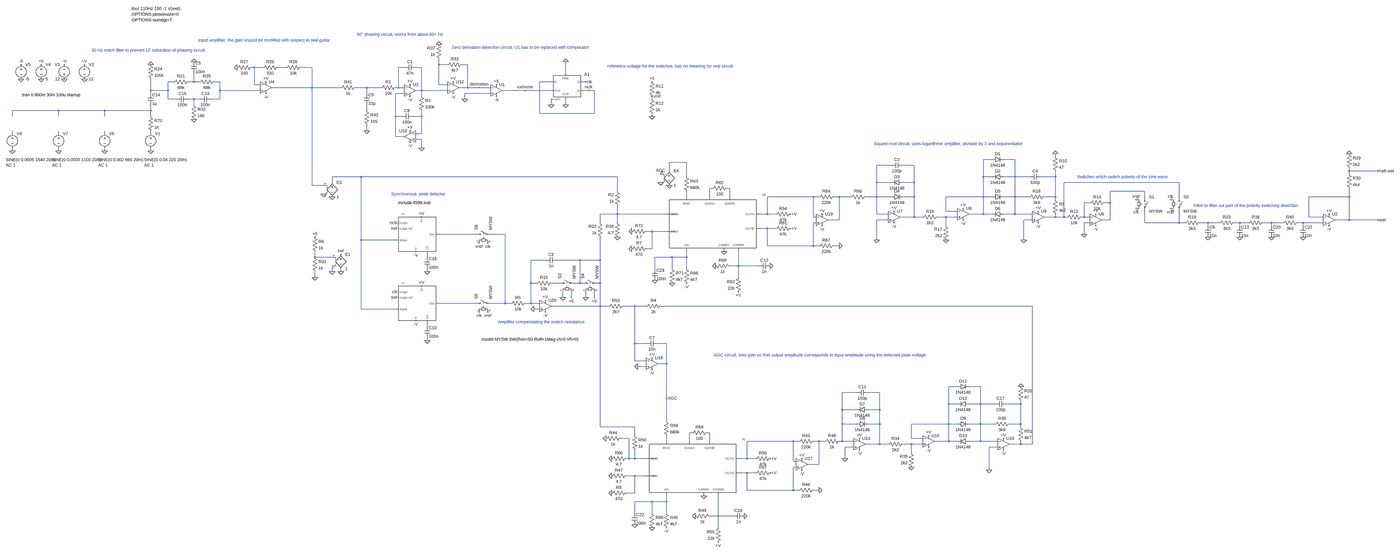
[diagram p0: schematic subharmonic_generator.asc, whole sheet]
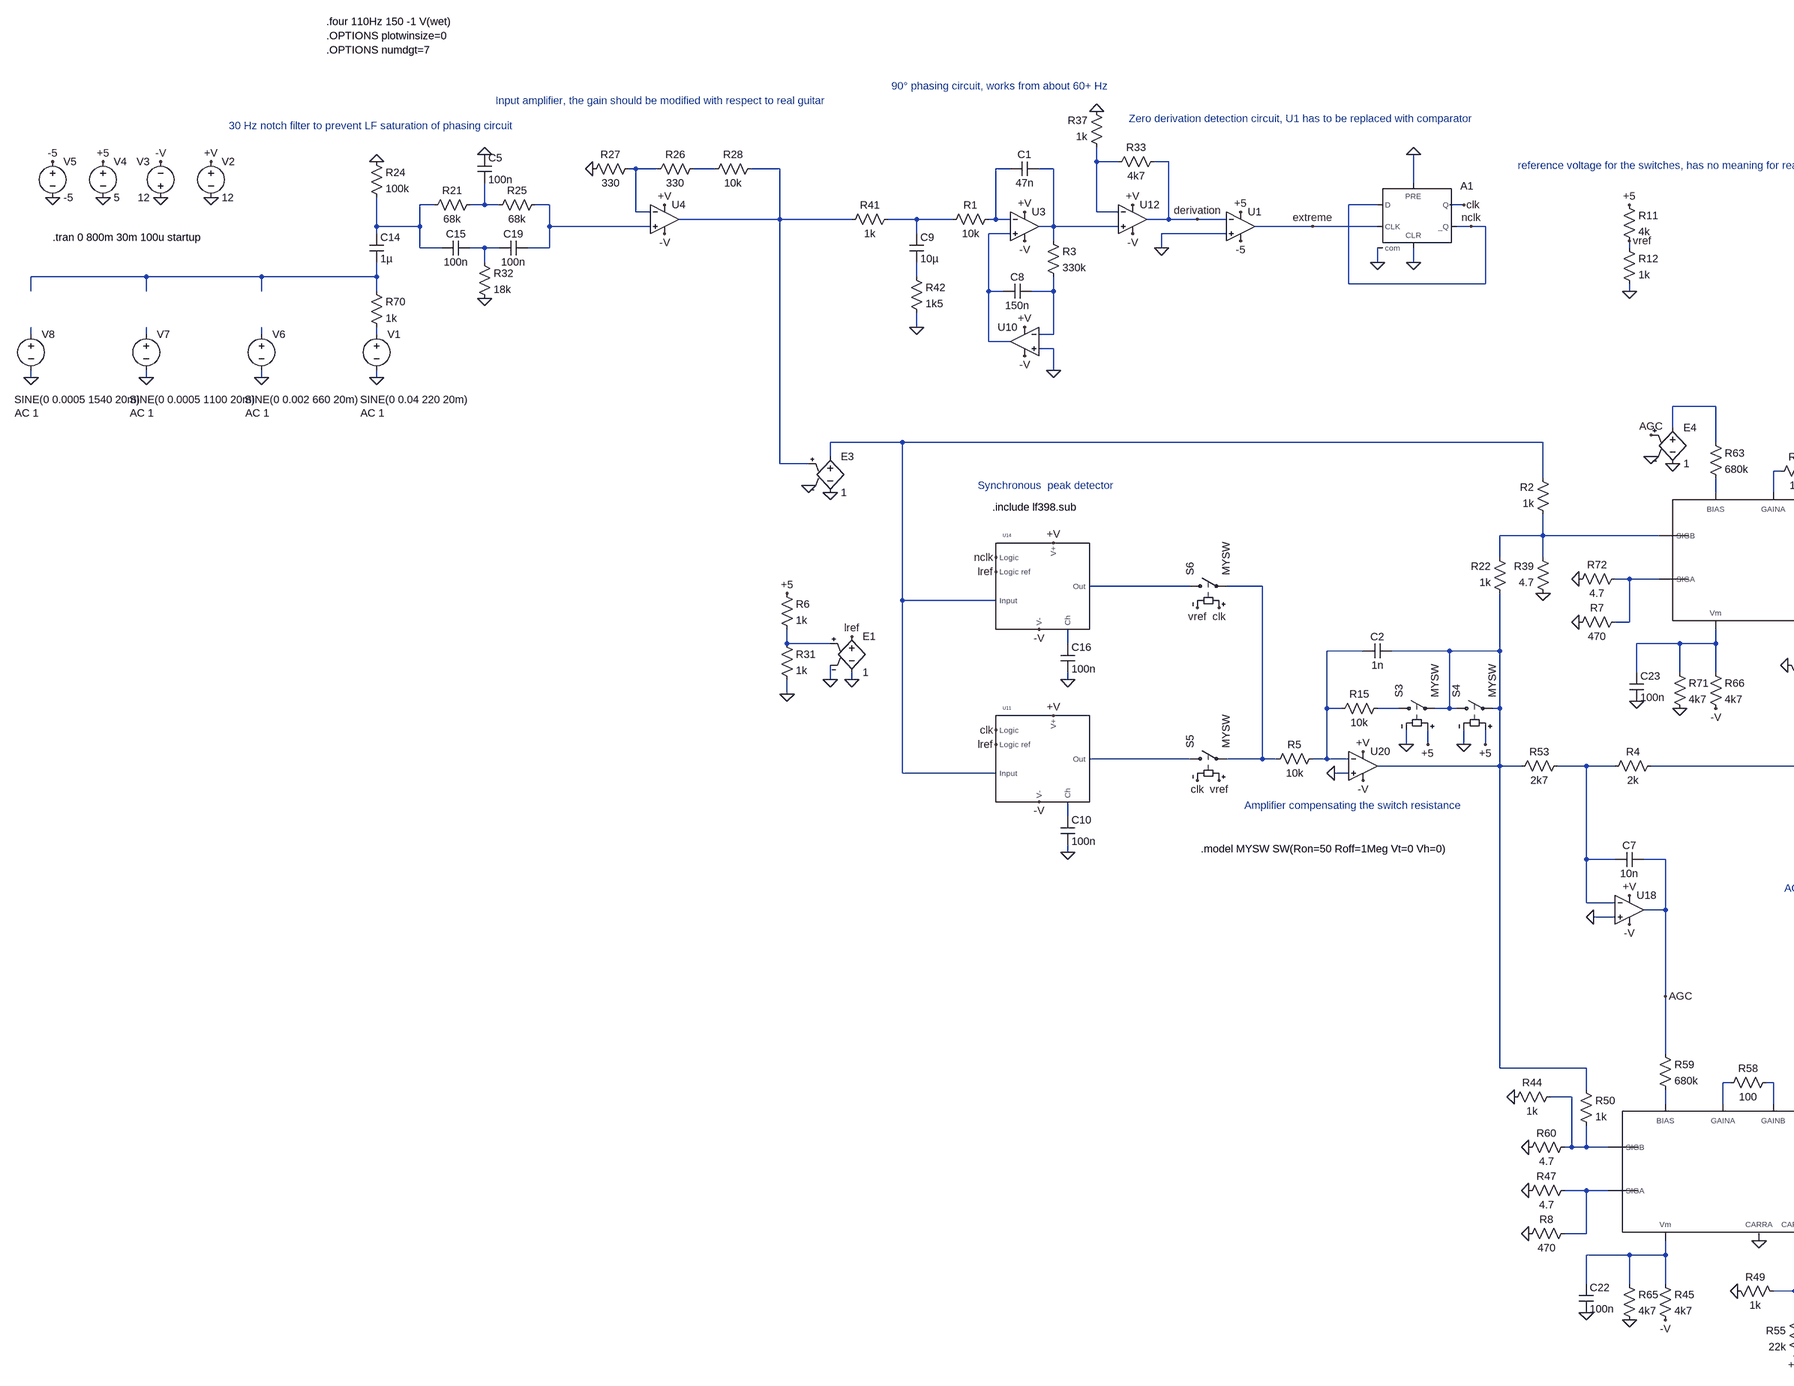
[diagram p1: schematic subharmonic_generator.asc, part, row 1 of 1, column 1 of 2]
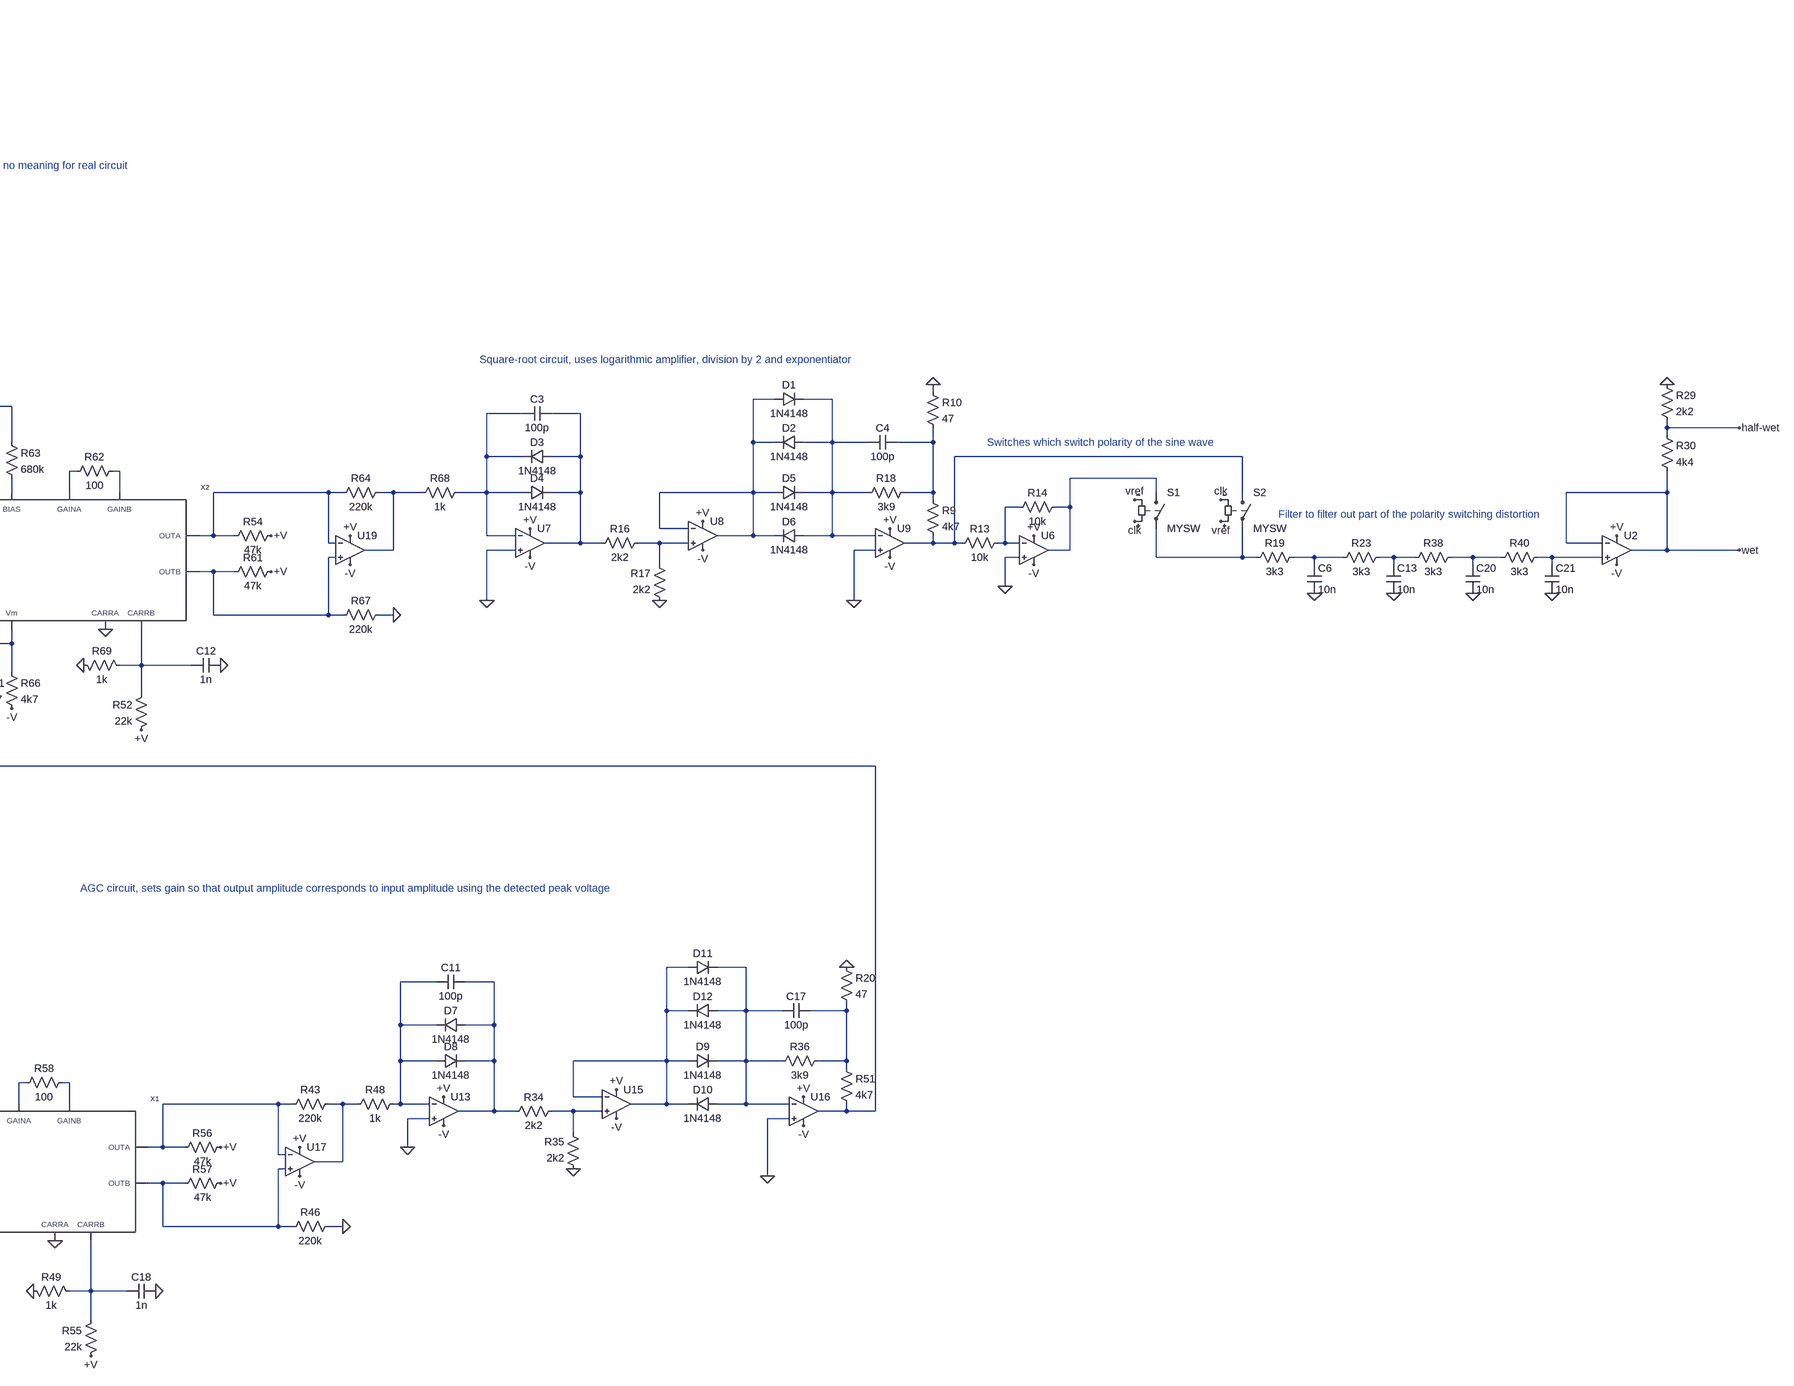
[diagram p2: schematic subharmonic_generator.asc, part, row 1 of 1, column 2 of 2]
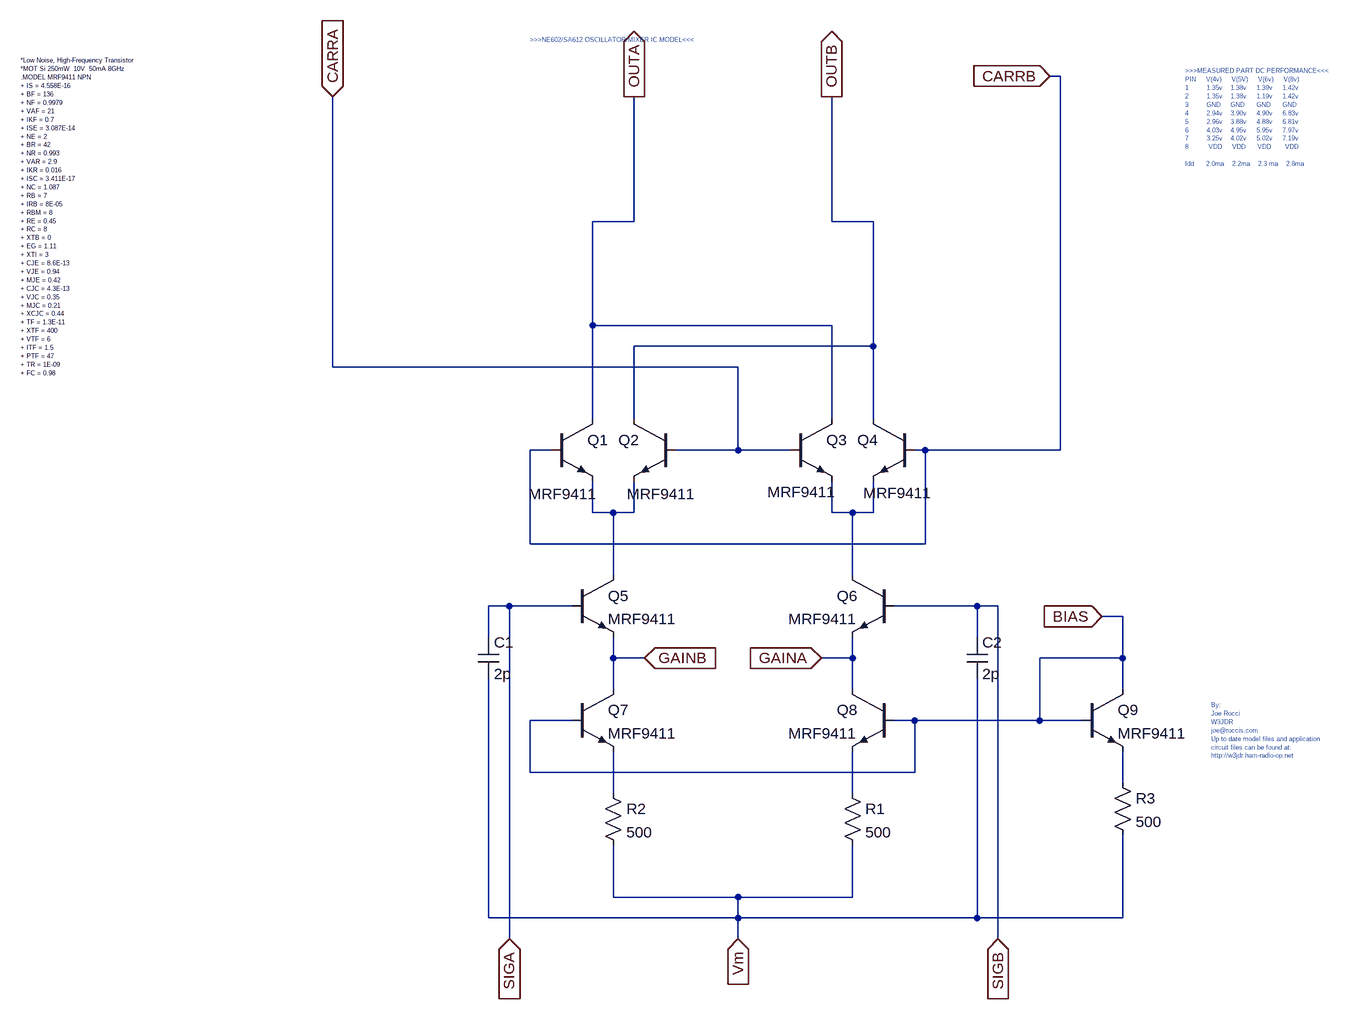
[diagram p3: sub-circuit gilbert.asc]
subharmonic_generator.asc, the LTspice schematic file:
Version 4
SHEET 1 5952 2332
WIRE 480 -400 480 -432
WIRE 528 -400 480 -400
WIRE 640 -400 608 -400
WIRE -544 -384 -560 -384
WIRE -496 -384 -544 -384
WIRE -368 -384 -416 -384
WIRE -224 -384 -288 -384
WIRE 288 -384 256 -384
WIRE 384 -384 352 -384
WIRE 1184 -352 1184 -416
WIRE -992 -304 -1024 -304
WIRE -880 -304 -880 -352
WIRE -880 -304 -912 -304
WIRE -848 -304 -880 -304
WIRE -736 -304 -768 -304
WIRE 1104 -304 1040 -304
WIRE 1296 -304 1264 -304
WIRE -544 -288 -544 -384
WIRE -512 -288 -544 -288
WIRE 480 -288 480 -400
WIRE 528 -288 480 -288
WIRE -224 -272 -224 -384
WIRE -224 -272 -448 -272
WIRE -64 -272 -224 -272
WIRE 80 -272 16 -272
WIRE 160 -272 80 -272
WIRE 256 -272 256 -384
WIRE 256 -272 240 -272
WIRE 288 -272 256 -272
WIRE 640 -272 640 -400
WIRE 640 -272 592 -272
WIRE 704 -272 640 -272
WIRE 768 -272 704 -272
WIRE -1120 -256 -1120 -320
WIRE -1024 -256 -1024 -304
WIRE -1024 -256 -1120 -256
WIRE -736 -256 -736 -304
WIRE -512 -256 -736 -256
WIRE 384 -256 384 -384
WIRE 384 -256 352 -256
WIRE 528 -256 384 -256
WIRE 960 -256 832 -256
WIRE 1104 -256 960 -256
WIRE 1312 -256 1280 -256
WIRE 1344 -256 1312 -256
WIRE -1120 -240 -1120 -256
WIRE 80 -240 80 -272
WIRE 288 -240 240 -240
WIRE 768 -240 624 -240
WIRE 384 -224 384 -256
WIRE -1024 -208 -1024 -256
WIRE -976 -208 -1024 -208
WIRE -880 -208 -912 -208
WIRE -848 -208 -880 -208
WIRE -736 -208 -736 -256
WIRE -736 -208 -784 -208
WIRE 624 -208 624 -240
WIRE 1664 -208 1664 -224
WIRE -880 -176 -880 -208
WIRE 1104 -176 1104 -208
WIRE 1184 -176 1184 -208
WIRE -1632 -144 -1888 -144
WIRE -1376 -144 -1632 -144
WIRE -1120 -144 -1120 -176
WIRE -1120 -144 -1376 -144
WIRE 80 -144 80 -176
WIRE 1040 -128 1040 -304
WIRE 1344 -128 1344 -256
WIRE 1344 -128 1040 -128
WIRE -1888 -112 -1888 -144
WIRE -1632 -112 -1632 -144
WIRE -1376 -112 -1376 -144
WIRE -1120 -112 -1120 -144
WIRE 240 -112 240 -240
WIRE 272 -112 240 -112
WIRE 384 -112 384 -144
WIRE 384 -112 336 -112
WIRE 1664 -112 1664 -128
WIRE 80 -32 80 -64
WIRE -1888 -16 -1888 -32
WIRE -1632 -16 -1632 -32
WIRE -1376 -16 -1376 -32
WIRE -1120 -16 -1120 -32
WIRE 384 -16 384 -112
WIRE 384 -16 352 -16
WIRE 240 0 240 -112
WIRE 288 0 240 0
WIRE 384 16 352 16
WIRE 384 64 384 16
WIRE -1888 80 -1888 64
WIRE -1632 80 -1632 64
WIRE -1376 80 -1376 64
WIRE -1120 80 -1120 64
WIRE 3904 112 3904 96
WIRE 3552 128 3504 128
WIRE 3680 128 3616 128
WIRE 1856 144 1760 144
WIRE 2992 160 2912 160
WIRE 3120 160 3056 160
WIRE 1760 192 1760 144
WIRE 5536 192 5536 176
WIRE 5696 192 5536 192
WIRE 5536 208 5536 192
WIRE 48 224 -112 224
WIRE 1472 224 48 224
WIRE 1856 224 1856 144
WIRE 3504 224 3504 128
WIRE 3552 224 3504 224
WIRE 3680 224 3680 128
WIRE 3680 224 3616 224
WIRE 3760 224 3680 224
WIRE 3904 224 3904 192
WIRE 3904 224 3824 224
WIRE -112 256 -112 224
WIRE 2912 256 2912 160
WIRE 2992 256 2912 256
WIRE 3120 256 3120 160
WIRE 3120 256 3056 256
WIRE 4592 256 3952 256
WIRE -224 272 -224 -272
WIRE -160 272 -224 272
WIRE 2000 288 1984 288
WIRE 2096 288 2080 288
WIRE 1472 304 1472 224
WIRE 4400 304 4208 304
WIRE 1856 336 1856 304
WIRE 1984 336 1984 288
WIRE 2096 336 2096 288
WIRE 2560 336 2304 336
WIRE 2592 336 2560 336
WIRE 2704 336 2672 336
WIRE 2768 336 2704 336
WIRE 2912 336 2912 256
WIRE 2912 336 2848 336
WIRE 2992 336 2912 336
WIRE 3120 336 3120 256
WIRE 3120 336 3056 336
WIRE 3504 336 3504 224
WIRE 3504 336 3296 336
WIRE 3552 336 3504 336
WIRE 3680 336 3680 224
WIRE 3680 336 3616 336
WIRE 3760 336 3680 336
WIRE 3904 336 3904 224
WIRE 3904 336 3840 336
WIRE 4400 336 4400 304
WIRE 4592 336 4592 256
WIRE 5536 336 5536 288
WIRE 5536 336 5312 336
WIRE 3904 352 3904 336
WIRE 4096 368 4064 368
WIRE 4208 368 4208 304
WIRE 4208 368 4176 368
WIRE 3296 416 3296 336
WIRE 3360 416 3296 416
WIRE 1472 432 1472 384
WIRE 1472 432 1376 432
WIRE 1728 432 1472 432
WIRE 2304 432 2304 336
WIRE 2304 432 2272 432
WIRE 2352 432 2304 432
WIRE 2912 432 2912 336
WIRE 2976 432 2912 432
WIRE 3504 432 3504 336
WIRE 3504 432 3424 432
WIRE 3552 432 3504 432
WIRE 3680 432 3680 336
WIRE 3680 432 3616 432
WIRE 3776 432 3680 432
WIRE 2560 448 2560 336
WIRE 2576 448 2560 448
WIRE 3120 448 3120 336
WIRE 3120 448 3040 448
WIRE 3168 448 3120 448
WIRE 3296 448 3248 448
WIRE 3360 448 3296 448
WIRE 3904 448 3904 432
WIRE 3904 448 3840 448
WIRE 3952 448 3952 256
WIRE 3952 448 3904 448
WIRE 3968 448 3952 448
WIRE 4064 448 4064 368
WIRE 4064 448 4048 448
WIRE 4096 448 4064 448
WIRE 5312 448 5312 336
WIRE 5392 448 5312 448
WIRE 2704 464 2704 336
WIRE 2704 464 2640 464
WIRE 2976 464 2912 464
WIRE 3776 464 3728 464
WIRE 4208 464 4208 368
WIRE 4208 464 4160 464
WIRE 5536 464 5536 336
WIRE 5536 464 5456 464
WIRE 5696 464 5536 464
WIRE 1376 480 1376 432
WIRE 1472 480 1472 432
WIRE 2576 480 2560 480
WIRE 4096 480 4064 480
WIRE 4400 480 4400 416
WIRE 4592 480 4592 416
WIRE 4592 480 4400 480
WIRE 4624 480 4592 480
WIRE 4752 480 4704 480
WIRE 4816 480 4752 480
WIRE 4928 480 4896 480
WIRE 4976 480 4928 480
WIRE 5104 480 5056 480
WIRE 5168 480 5104 480
WIRE 5280 480 5248 480
WIRE 5392 480 5280 480
WIRE 3296 496 3296 448
WIRE 4752 496 4752 480
WIRE 4928 496 4928 480
WIRE 5104 496 5104 480
WIRE 5280 496 5280 480
WIRE 2304 512 2272 512
WIRE 2352 512 2304 512
WIRE 1664 528 1632 528
WIRE 1728 528 1664 528
WIRE 688 544 464 544
WIRE 848 544 768 544
WIRE 4064 544 4064 480
WIRE 48 576 48 224
WIRE 256 576 48 576
WIRE 2912 576 2912 464
WIRE 3728 576 3728 464
WIRE 2304 608 2304 512
WIRE 2560 608 2560 480
WIRE 2560 608 2304 608
WIRE 2592 608 2560 608
WIRE 2704 608 2672 608
WIRE 1664 624 1664 528
WIRE 1664 624 1632 624
WIRE -208 672 -208 640
WIRE -112 672 -208 672
WIRE 416 672 416 640
WIRE 1776 672 1680 672
WIRE 1856 672 1856 640
WIRE 1856 672 1776 672
WIRE 1072 688 992 688
WIRE 1264 688 1136 688
WIRE 1376 688 1376 560
WIRE 1376 688 1264 688
WIRE 2144 720 2144 640
WIRE 2144 720 2096 720
WIRE 2256 720 2144 720
WIRE 1680 736 1680 672
WIRE 1776 736 1776 672
WIRE 1856 736 1856 672
WIRE -112 752 -112 720
WIRE -64 752 -64 736
WIRE 416 752 416 736
WIRE -208 784 -208 752
WIRE 2144 784 2144 720
WIRE 992 816 992 688
WIRE 1024 816 992 816
WIRE 1152 816 1104 816
WIRE 1264 816 1264 688
WIRE 1264 816 1232 816
WIRE 1280 816 1264 816
WIRE 1376 816 1376 688
WIRE 1376 816 1360 816
WIRE 1168 896 1168 864
WIRE 1216 896 1216 864
WIRE 1296 896 1296 864
WIRE 1344 896 1344 864
WIRE 688 928 464 928
WIRE 848 928 848 544
WIRE 848 928 768 928
WIRE 880 928 848 928
WIRE 992 928 992 816
WIRE 992 928 960 928
WIRE 1040 928 992 928
WIRE 1376 944 1376 816
WIRE 1376 944 1104 944
WIRE 1424 944 1376 944
WIRE 1568 944 1504 944
WIRE 1632 944 1568 944
WIRE 3776 944 1712 944
WIRE 48 960 48 576
WIRE 256 960 48 960
WIRE 1040 960 1008 960
WIRE 416 1056 416 1024
WIRE 416 1136 416 1120
WIRE 1568 1152 1568 944
WIRE 1632 1152 1568 1152
WIRE 1744 1152 1696 1152
WIRE 1568 1248 1568 1152
WIRE 1632 1248 1568 1248
WIRE 1744 1264 1744 1152
WIRE 1744 1264 1696 1264
WIRE 1632 1280 1584 1280
WIRE 3360 1392 3312 1392
WIRE 3488 1392 3424 1392
WIRE 2800 1424 2720 1424
WIRE 2928 1424 2864 1424
WIRE 1744 1456 1744 1264
WIRE 3312 1488 3312 1392
WIRE 3360 1488 3312 1488
WIRE 3488 1488 3488 1392
WIRE 3488 1488 3424 1488
WIRE 3568 1488 3488 1488
WIRE 3712 1488 3712 1472
WIRE 3712 1488 3632 1488
WIRE 2720 1520 2720 1424
WIRE 2800 1520 2720 1520
WIRE 2928 1520 2928 1424
WIRE 2928 1520 2864 1520
WIRE 1744 1584 1744 1456
WIRE 2720 1600 2720 1520
WIRE 2800 1600 2720 1600
WIRE 2928 1600 2928 1520
WIRE 2928 1600 2864 1600
WIRE 3312 1600 3312 1488
WIRE 3312 1600 3104 1600
WIRE 3360 1600 3312 1600
WIRE 3488 1600 3488 1488
WIRE 3488 1600 3424 1600
WIRE 3568 1600 3488 1600
WIRE 3712 1600 3712 1488
WIRE 3712 1600 3648 1600
WIRE 1376 1616 1376 944
WIRE 1568 1616 1376 1616
WIRE 3712 1616 3712 1600
WIRE 1888 1648 1872 1648
WIRE 1984 1648 1968 1648
WIRE 1568 1664 1568 1616
WIRE 1536 1680 1488 1680
WIRE 3104 1680 3104 1600
WIRE 3168 1680 3104 1680
WIRE 1744 1696 1744 1664
WIRE 1872 1696 1872 1648
WIRE 1984 1696 1984 1648
WIRE 2448 1696 2192 1696
WIRE 2480 1696 2448 1696
WIRE 2592 1696 2560 1696
WIRE 2624 1696 2592 1696
WIRE 2720 1696 2720 1600
WIRE 2720 1696 2704 1696
WIRE 2784 1696 2720 1696
WIRE 3312 1696 3312 1600
WIRE 3312 1696 3232 1696
WIRE 3360 1696 3312 1696
WIRE 3488 1696 3488 1600
WIRE 3488 1696 3424 1696
WIRE 3584 1696 3488 1696
WIRE 2928 1712 2928 1600
WIRE 2928 1712 2848 1712
WIRE 2976 1712 2928 1712
WIRE 3104 1712 3056 1712
WIRE 3168 1712 3104 1712
WIRE 3712 1712 3712 1696
WIRE 3712 1712 3648 1712
WIRE 3776 1712 3776 944
WIRE 3776 1712 3712 1712
WIRE 2784 1728 2736 1728
WIRE 3584 1728 3536 1728
WIRE 3104 1760 3104 1712
WIRE 1536 1792 1536 1680
WIRE 1536 1792 1520 1792
WIRE 1568 1792 1568 1744
WIRE 1568 1792 1536 1792
WIRE 1616 1792 1568 1792
WIRE 2192 1792 2192 1696
WIRE 2192 1792 2160 1792
WIRE 2240 1792 2192 1792
WIRE 2736 1792 2736 1728
WIRE 2448 1808 2448 1696
WIRE 2464 1808 2448 1808
WIRE 2592 1824 2592 1696
WIRE 2592 1824 2528 1824
WIRE 2464 1840 2448 1840
WIRE 3536 1856 3536 1728
WIRE 2192 1872 2160 1872
WIRE 2240 1872 2192 1872
WIRE 1568 1888 1520 1888
WIRE 1616 1888 1568 1888
WIRE 2192 1968 2192 1872
WIRE 2448 1968 2448 1840
WIRE 2448 1968 2192 1968
WIRE 2480 1968 2448 1968
WIRE 2592 1968 2560 1968
WIRE 1568 1984 1568 1888
WIRE 1568 1984 1520 1984
WIRE 1664 2032 1568 2032
WIRE 1744 2032 1744 2000
WIRE 1744 2032 1664 2032
WIRE 1568 2096 1568 2032
WIRE 1664 2096 1664 2032
WIRE 1744 2096 1744 2032
WIRE 2032 2112 2032 2000
WIRE 2032 2112 1984 2112
WIRE 2112 2112 2032 2112
WIRE 2032 2176 2032 2112
FLAG -1120 80 0
FLAG -1600 -320 0
FLAG -1488 -320 0
FLAG -1488 -400 +V
FLAG -1600 -400 -V
FLAG 320 -288 +V
FLAG 320 -224 -V
FLAG 624 -208 0
FLAG 1184 -176 0
FLAG 1184 -416 0
FLAG -1728 -320 0
FLAG -1728 -400 +5
FLAG 1664 -112 0
FLAG 1664 -304 +5
FLAG 1664 -224 vref
FLAG 1296 -304 clk
FLAG 4128 432 +V
FLAG 4128 496 -V
FLAG 4352 352 vref
FLAG 4352 400 clk
FLAG 4544 352 clk
FLAG 4544 400 vref
FLAG 3008 416 +V
FLAG 3008 480 -V
FLAG 3296 576 0
FLAG 3392 400 +V
FLAG 3392 464 -V
FLAG 2912 576 0
FLAG 3808 416 +V
FLAG 3808 480 -V
FLAG 4752 560 0
FLAG 320 -32 +V
FLAG 320 32 -V
FLAG 752 976 vref
FLAG 704 976 clk
FLAG 704 592 vref
FLAG 752 592 clk
FLAG 4928 560 0
FLAG 5424 432 +V
FLAG 5424 496 -V
FLAG -480 -304 +V
FLAG -480 -240 -V
FLAG -1120 -400 0
FLAG -640 -384 0
FLAG 5696 464 wet
FLAG 5696 192 half-wet
FLAG 384 448 +V
FLAG 352 640 -V
FLAG 416 752 0
FLAG 256 480 nclk
FLAG 384 832 +V
FLAG 352 1024 -V
FLAG 416 1136 0
FLAG 256 864 clk
FLAG 1312 -256 nclk
FLAG 256 512 lref
FLAG 256 896 lref
FLAG -208 784 0
FLAG -208 560 +5
FLAG -64 656 lref
FLAG 1104 -176 0
FLAG 704 -272 derivation
FLAG 960 -256 extreme
FLAG -112 752 0
FLAG -64 752 0
FLAG 3728 576 0
FLAG 2816 1680 +V
FLAG 2816 1744 -V
FLAG 3104 1840 0
FLAG 3200 1664 +V
FLAG 3200 1728 -V
FLAG 2736 1792 0
FLAG 3616 1680 +V
FLAG 3616 1744 -V
FLAG 3536 1856 0
FLAG 384 64 0
FLAG 1664 1296 -V
FLAG 1664 1232 +V
FLAG 80 -32 0
FLAG -160 320 0
FLAG -112 336 0
FLAG -880 -96 0
FLAG -880 -416 0
FLAG 560 -304 +V
FLAG 560 -240 -V
FLAG 480 -512 0
FLAG 5104 560 0
FLAG 5280 560 0
FLAG 1584 1280 0
FLAG -1840 -320 0
FLAG -1840 -400 -5
FLAG 2032 2256 +V
FLAG 2496 1792 +V
FLAG 2496 1856 -V
FLAG 2592 1968 0
FLAG 2320 1792 +V
FLAG 2320 1872 +V
FLAG 1904 2112 0
FLAG 1440 1792 0
FLAG 1952 2000 0
FLAG 1744 1456 AGC
FLAG 2144 864 +V
FLAG 2608 432 +V
FLAG 2608 496 -V
FLAG 2704 608 0
FLAG 2432 432 +V
FLAG 2432 512 +V
FLAG 2016 720 0
FLAG 2064 640 0
FLAG 1552 528 0
FLAG 1712 208 AGC
FLAG 800 -288 +5
FLAG 800 -224 -5
FLAG 1072 976 -V
FLAG 1072 912 +V
FLAG 1008 960 0
FLAG 1168 896 0
FLAG 1216 896 +5
FLAG 1296 896 0
FLAG 1344 896 +5
FLAG 1472 560 0
FLAG 1712 256 0
FLAG 1760 272 0
FLAG 5536 96 0
FLAG 1552 624 0
FLAG 1440 1888 0
FLAG 1440 1984 0
FLAG 2176 2112 0
FLAG 2320 720 0
FLAG 3904 96 0
FLAG 3712 1392 0
FLAG -1376 80 0
FLAG -1632 80 0
FLAG -1888 80 0
FLAG 1408 1680 0
FLAG 4064 544 0
FLAG 1664 2176 0
FLAG 1568 2160 0
FLAG 1744 2176 -V
FLAG 1776 816 0
FLAG 1680 800 0
FLAG 1856 816 -V
SYMBOL voltage -1120 -32 R0
WINDOW 123 -36 191 Left 2
WINDOW 39 0 0 Left 0
WINDOW 3 -37 161 Left 2
SYMATTR Value2 AC 1
SYMATTR Value SINE(0 0.04 220 20m)
SYMATTR InstName V1
SYMBOL voltage -1488 -416 R0
WINDOW 123 0 0 Left 0
WINDOW 39 0 0 Left 0
SYMATTR InstName V2
SYMATTR Value 12
SYMBOL voltage -1600 -304 R180
WINDOW 0 24 96 Left 2
WINDOW 3 24 16 Left 2
WINDOW 123 0 0 Left 0
WINDOW 39 0 0 Left 0
SYMATTR InstName V3
SYMATTR Value 12
SYMBOL res 256 -288 R90
WINDOW 0 0 56 VBottom 2
WINDOW 3 32 56 VTop 2
SYMATTR InstName R1
SYMATTR Value 10k
SYMBOL cap 352 -400 R90
WINDOW 0 0 32 VBottom 2
WINDOW 3 32 32 VTop 2
SYMATTR InstName C1
SYMATTR Value 47n
SYMBOL Opamps\\UniversalOpamp2 320 -256 R0
SYMATTR InstName U3
SYMBOL Digital\\dflop 1184 -352 R0
WINDOW 3 0 0 Invisible 0
SYMATTR Value Vhigh=5 Vlow=0 Ref=2.5 Trise=5n Tfall=5n Td=5n
SYMATTR InstName A1
SYMBOL voltage -1728 -416 R0
WINDOW 123 0 0 Left 0
WINDOW 39 0 0 Left 0
SYMATTR InstName V4
SYMATTR Value 5
SYMBOL sw 4400 320 R0
SYMATTR InstName S1
SYMATTR Value MYSW
SYMBOL res 1648 -320 R0
SYMATTR InstName R11
SYMATTR Value 4k
SYMBOL res 1648 -224 R0
SYMATTR InstName R12
SYMATTR Value 1k
SYMBOL Opamps\\UniversalOpamp2 4128 464 R0
SYMATTR InstName U6
SYMATTR SpiceLine2 en=0 enk=0 in=0 ink=0 Rin=5000Meg
SYMBOL res 4064 432 R90
WINDOW 0 0 56 VBottom 2
WINDOW 3 32 56 VTop 2
SYMATTR InstName R13
SYMATTR Value 10k
SYMBOL res 4192 352 R90
WINDOW 0 0 56 VBottom 2
WINDOW 3 32 56 VTop 2
SYMATTR InstName R14
SYMATTR Value 10k
SYMBOL sw 4592 320 R0
SYMATTR InstName S2
SYMATTR Value MYSW
SYMBOL Opamps\\UniversalOpamp2 3008 448 R0
SYMATTR InstName U7
SYMBOL diode 3056 240 R90
WINDOW 0 0 32 VBottom 2
WINDOW 3 32 32 VTop 2
SYMATTR InstName D3
SYMATTR Value 1N4148
SYMBOL diode 2992 352 R270
WINDOW 0 32 32 VTop 2
WINDOW 3 0 32 VBottom 2
SYMATTR InstName D4
SYMATTR Value 1N4148
SYMBOL res 3264 432 R90
WINDOW 0 0 56 VBottom 2
WINDOW 3 32 56 VTop 2
SYMATTR InstName R16
SYMATTR Value 2k2
SYMBOL res 3312 592 R180
WINDOW 0 36 76 Left 2
WINDOW 3 36 40 Left 2
SYMATTR InstName R17
SYMATTR Value 2k2
SYMBOL Opamps\\UniversalOpamp2 3392 432 R0
SYMATTR InstName U8
SYMBOL diode 3552 352 R270
WINDOW 0 32 32 VTop 2
WINDOW 3 0 32 VBottom 2
SYMATTR InstName D5
SYMATTR Value 1N4148
SYMBOL diode 3616 416 R90
WINDOW 0 0 32 VBottom 2
WINDOW 3 32 32 VTop 2
SYMATTR InstName D6
SYMATTR Value 1N4148
SYMBOL Opamps\\UniversalOpamp2 3808 448 R0
SYMATTR InstName U9
SYMBOL res 3856 320 R90
WINDOW 0 0 56 VBottom 2
WINDOW 3 32 56 VTop 2
SYMATTR InstName R18
SYMATTR Value 3k9
SYMBOL res 4720 464 R90
WINDOW 0 0 56 VBottom 2
WINDOW 3 32 56 VTop 2
SYMATTR InstName R19
SYMATTR Value 3k3
SYMBOL cap 4736 496 R0
SYMATTR InstName C6
SYMATTR Value 10n
SYMBOL Opamps\\UniversalOpamp2 320 0 M0
SYMATTR InstName U10
SYMBOL cap 336 -128 R90
WINDOW 0 0 32 VBottom 2
WINDOW 3 32 32 VTop 2
SYMATTR InstName C8
SYMATTR Value 150n
SYMBOL res 368 -240 R0
SYMATTR InstName R3
SYMATTR Value 330k
SYMBOL sw 672 928 R270
SYMATTR InstName S5
SYMATTR Value MYSW
SYMBOL sw 672 544 R270
SYMATTR InstName S6
SYMATTR Value MYSW
SYMBOL cap 3056 144 R90
WINDOW 0 0 32 VBottom 2
WINDOW 3 32 32 VTop 2
SYMATTR InstName C3
SYMATTR Value 100p
SYMBOL cap 3824 208 R90
WINDOW 0 0 32 VBottom 2
WINDOW 3 32 32 VTop 2
SYMATTR InstName C4
SYMATTR Value 100p
SYMBOL res 4912 464 R90
WINDOW 0 0 56 VBottom 2
WINDOW 3 32 56 VTop 2
SYMATTR InstName R23
SYMATTR Value 3k3
SYMBOL cap 4912 496 R0
SYMATTR InstName C13
SYMATTR Value 10n
SYMBOL Opamps\\UniversalOpamp2 5424 464 R0
SYMATTR InstName U2
SYMBOL Opamps\\UniversalOpamp2 -480 -272 R0
SYMATTR InstName U4
SYMBOL cap -1136 -240 R0
SYMATTR InstName C14
SYMATTR Value 1µ
SYMBOL res -1136 -416 R0
SYMATTR InstName R24
SYMATTR Value 100k
SYMBOL res -400 -400 R90
WINDOW 0 0 56 VBottom 2
WINDOW 3 32 56 VTop 2
SYMATTR InstName R26
SYMATTR Value 330
SYMBOL res -544 -400 R90
WINDOW 0 0 56 VBottom 2
WINDOW 3 32 56 VTop 2
SYMATTR InstName R27
SYMATTR Value 330
SYMBOL res -272 -400 R90
WINDOW 0 0 56 VBottom 2
WINDOW 3 32 56 VTop 2
SYMATTR InstName R28
SYMATTR Value 10k
SYMBOL res 5520 80 R0
SYMATTR InstName R29
SYMATTR Value 2k2
SYMBOL res 5520 192 R0
SYMATTR InstName R30
SYMATTR Value 4k4
SYMBOL lf398 336 512 R0
SYMATTR InstName U14
SYMATTR Value LF398J
SYMBOL cap 400 672 R0
SYMATTR InstName C16
SYMATTR Value 100n
SYMBOL lf398 336 896 R0
SYMATTR InstName U11
SYMATTR Value LF398J
SYMBOL cap 400 1056 R0
SYMATTR InstName C10
SYMATTR Value 100n
SYMBOL res -224 544 R0
SYMATTR InstName R6
SYMATTR Value 1k
SYMBOL res -224 656 R0
SYMATTR InstName R31
SYMATTR Value 1k
SYMBOL e -64 640 R0
SYMATTR InstName E1
SYMATTR Value 1
SYMBOL diode 3552 144 R270
WINDOW 0 32 32 VTop 2
WINDOW 3 0 32 VBottom 2
SYMATTR InstName D1
SYMATTR Value 1N4148
SYMBOL diode 3616 208 R90
WINDOW 0 0 32 VBottom 2
WINDOW 3 32 32 VTop 2
SYMATTR InstName D2
SYMATTR Value 1N4148
SYMBOL Opamps\\UniversalOpamp2 2816 1712 R0
SYMATTR InstName U13
SYMBOL diode 2864 1504 R90
WINDOW 0 0 32 VBottom 2
WINDOW 3 32 32 VTop 2
SYMATTR InstName D7
SYMATTR Value 1N4148
SYMBOL diode 2800 1616 R270
WINDOW 0 32 32 VTop 2
WINDOW 3 0 32 VBottom 2
SYMATTR InstName D8
SYMATTR Value 1N4148
SYMBOL res 3072 1696 R90
WINDOW 0 0 56 VBottom 2
WINDOW 3 32 56 VTop 2
SYMATTR InstName R34
SYMATTR Value 2k2
SYMBOL res 3120 1856 R180
WINDOW 0 36 76 Left 2
WINDOW 3 36 40 Left 2
SYMATTR InstName R35
SYMATTR Value 2k2
SYMBOL Opamps\\UniversalOpamp2 3200 1696 R0
SYMATTR InstName U15
SYMBOL diode 3360 1616 R270
WINDOW 0 32 32 VTop 2
WINDOW 3 0 32 VBottom 2
SYMATTR InstName D9
SYMATTR Value 1N4148
SYMBOL diode 3424 1680 R90
WINDOW 0 0 32 VBottom 2
WINDOW 3 32 32 VTop 2
SYMATTR InstName D10
SYMATTR Value 1N4148
SYMBOL Opamps\\UniversalOpamp2 3616 1712 R0
SYMATTR InstName U16
SYMBOL res 3664 1584 R90
WINDOW 0 0 56 VBottom 2
WINDOW 3 32 56 VTop 2
SYMATTR InstName R36
SYMATTR Value 3k9
SYMBOL cap 2864 1408 R90
WINDOW 0 0 32 VBottom 2
WINDOW 3 32 32 VTop 2
SYMATTR InstName C11
SYMATTR Value 100p
SYMBOL cap 3632 1472 R90
WINDOW 0 0 32 VBottom 2
WINDOW 3 32 32 VTop 2
SYMATTR InstName C17
SYMATTR Value 100p
SYMBOL diode 3360 1408 R270
WINDOW 0 32 32 VTop 2
WINDOW 3 0 32 VBottom 2
SYMATTR InstName D11
SYMATTR Value 1N4148
SYMBOL diode 3424 1472 R90
WINDOW 0 0 32 VBottom 2
WINDOW 3 32 32 VTop 2
SYMATTR InstName D12
SYMATTR Value 1N4148
SYMBOL Opamps\\UniversalOpamp2 1664 1264 R0
SYMATTR InstName U18
SYMBOL res 1728 928 R90
WINDOW 0 0 56 VBottom 2
WINDOW 3 32 56 VTop 2
SYMATTR InstName R4
SYMATTR Value 2k
SYMBOL cap 1696 1136 R90
WINDOW 0 0 32 VBottom 2
WINDOW 3 32 32 VTop 2
SYMATTR InstName C7
SYMATTR Value 10n
SYMBOL res 32 -288 R90
WINDOW 0 0 56 VBottom 2
WINDOW 3 32 56 VTop 2
SYMATTR InstName R41
SYMATTR Value 1k
SYMBOL cap 64 -240 R0
SYMATTR InstName C9
SYMATTR Value 10µ
SYMBOL res 64 -160 R0
SYMATTR InstName R42
SYMATTR Value 1k5
SYMBOL e -112 240 R0
SYMATTR InstName E3
SYMATTR Value 1
SYMBOL res -896 -320 R90
WINDOW 0 0 56 VBottom 2
WINDOW 3 32 56 VTop 2
SYMATTR InstName R21
SYMATTR Value 68k
SYMBOL res -752 -320 R90
WINDOW 0 0 56 VBottom 2
WINDOW 3 32 56 VTop 2
SYMATTR InstName R25
SYMATTR Value 68k
SYMBOL cap -896 -416 R0
SYMATTR InstName C5
SYMATTR Value 100n
SYMBOL cap -912 -224 R90
WINDOW 0 0 32 VBottom 2
WINDOW 3 32 32 VTop 2
SYMATTR InstName C15
SYMATTR Value 100n
SYMBOL cap -784 -224 R90
WINDOW 0 0 32 VBottom 2
WINDOW 3 32 32 VTop 2
SYMATTR InstName C19
SYMATTR Value 100n
SYMBOL res -896 -192 R0
SYMATTR InstName R32
SYMATTR Value 18k
SYMBOL Opamps\\UniversalOpamp2 560 -272 R0
SYMATTR InstName U12
SYMBOL res 624 -416 R90
WINDOW 0 0 56 VBottom 2
WINDOW 3 32 56 VTop 2
SYMATTR InstName R33
SYMATTR Value 4k7
SYMBOL res 496 -416 R180
WINDOW 0 36 76 Left 2
WINDOW 3 36 40 Left 2
SYMATTR InstName R37
SYMATTR Value 1k
SYMBOL res 5072 464 R90
WINDOW 0 0 56 VBottom 2
WINDOW 3 32 56 VTop 2
SYMATTR InstName R38
SYMATTR Value 3k3
SYMBOL cap 5088 496 R0
SYMATTR InstName C20
SYMATTR Value 10n
SYMBOL res 5264 464 R90
WINDOW 0 0 56 VBottom 2
WINDOW 3 32 56 VTop 2
SYMATTR InstName R40
SYMATTR Value 3k3
SYMBOL cap 5264 496 R0
SYMATTR InstName C21
SYMATTR Value 10n
SYMBOL res 1520 928 R90
WINDOW 0 0 56 VBottom 2
WINDOW 3 32 56 VTop 2
SYMATTR InstName R53
SYMATTR Value 2k7
SYMBOL gilbert 1856 1840 R0
SYMATTR InstName X1
SYMBOL voltage -1840 -416 R0
WINDOW 123 0 0 Left 0
WINDOW 39 0 0 Left 0
SYMATTR InstName V5
SYMATTR Value -5
SYMBOL res 2048 2160 M0
SYMATTR InstName R55
SYMATTR Value 22k
SYMBOL res 2336 1776 R90
WINDOW 0 0 56 VBottom 2
WINDOW 3 32 56 VTop 2
SYMATTR InstName R56
SYMATTR Value 47k
SYMBOL res 2336 1856 R90
WINDOW 0 0 56 VBottom 2
WINDOW 3 32 56 VTop 2
SYMATTR InstName R57
SYMATTR Value 47k
SYMBOL res 1984 1632 R90
WINDOW 0 0 56 VBottom 2
WINDOW 3 32 56 VTop 2
SYMATTR InstName R58
SYMATTR Value 100
SYMBOL res 1728 1568 R0
SYMATTR InstName R59
SYMATTR Value 680k
SYMBOL Opamps\\UniversalOpamp2 2496 1824 R0
SYMATTR InstName U17
SYMBOL res 2576 1680 R90
WINDOW 0 0 56 VBottom 2
WINDOW 3 32 56 VTop 2
SYMATTR InstName R43
SYMATTR Value 220k
SYMBOL res 2576 1952 R90
WINDOW 0 0 56 VBottom 2
WINDOW 3 32 56 VTop 2
SYMATTR InstName R46
SYMATTR Value 220k
SYMBOL res 2720 1680 R90
WINDOW 0 0 56 VBottom 2
WINDOW 3 32 56 VTop 2
SYMATTR InstName R48
SYMATTR Value 1k
SYMBOL res 1888 2096 M90
WINDOW 0 0 56 VBottom 2
WINDOW 3 32 56 VTop 2
SYMATTR InstName R49
SYMATTR Value 1k
SYMBOL res 1552 1648 R0
SYMATTR InstName R50
SYMATTR Value 1k
SYMBOL res 1536 1776 R90
WINDOW 0 0 56 VBottom 2
WINDOW 3 32 56 VTop 2
SYMATTR InstName R60
SYMATTR Value 4.7
SYMBOL res 1536 1872 R90
WINDOW 0 0 56 VBottom 2
WINDOW 3 32 56 VTop 2
SYMATTR InstName R47
SYMATTR Value 4.7
SYMBOL gilbert 1968 480 R0
SYMATTR InstName X2
SYMBOL res 2160 768 M0
SYMATTR InstName R52
SYMATTR Value 22k
SYMBOL res 2448 416 R90
WINDOW 0 0 56 VBottom 2
WINDOW 3 32 56 VTop 2
SYMATTR InstName R54
SYMATTR Value 47k
SYMBOL res 2448 496 R90
WINDOW 0 0 56 VBottom 2
WINDOW 3 32 56 VTop 2
SYMATTR InstName R61
SYMATTR Value 47k
SYMBOL res 2096 272 R90
WINDOW 0 0 56 VBottom 2
WINDOW 3 32 56 VTop 2
SYMATTR InstName R62
SYMATTR Value 100
SYMBOL res 1840 208 R0
SYMATTR InstName R63
SYMATTR Value 680k
SYMBOL Opamps\\UniversalOpamp2 2608 464 R0
SYMATTR InstName U19
SYMBOL res 2688 320 R90
WINDOW 0 0 56 VBottom 2
WINDOW 3 32 56 VTop 2
SYMATTR InstName R64
SYMATTR Value 220k
SYMBOL res 2688 592 R90
WINDOW 0 0 56 VBottom 2
WINDOW 3 32 56 VTop 2
SYMATTR InstName R67
SYMATTR Value 220k
SYMBOL res 2864 320 R90
WINDOW 0 0 56 VBottom 2
WINDOW 3 32 56 VTop 2
SYMATTR InstName R68
SYMATTR Value 1k
SYMBOL res 2000 704 M90
WINDOW 0 0 56 VBottom 2
WINDOW 3 32 56 VTop 2
SYMATTR InstName R69
SYMATTR Value 1k
SYMBOL res 1648 512 R90
WINDOW 0 0 56 VBottom 2
WINDOW 3 32 56 VTop 2
SYMATTR InstName R72
SYMATTR Value 4.7
SYMBOL Opamps\\UniversalOpamp2 800 -256 R0
SYMATTR InstName U1
SYMBOL Opamps\\UniversalOpamp2 1072 944 R0
SYMATTR InstName U20
SYMBOL res 976 912 R90
WINDOW 0 0 56 VBottom 2
WINDOW 3 32 56 VTop 2
SYMATTR InstName R5
SYMATTR Value 10k
SYMBOL res 1120 800 R90
WINDOW 0 0 56 VBottom 2
WINDOW 3 32 56 VTop 2
SYMATTR InstName R15
SYMATTR Value 10k
SYMBOL cap 1136 672 R90
WINDOW 0 0 32 VBottom 2
WINDOW 3 32 32 VTop 2
SYMATTR InstName C2
SYMATTR Value 1n
SYMBOL sw 1136 816 R270
SYMATTR InstName S3
SYMATTR Value MYSW
SYMBOL sw 1264 816 R270
SYMATTR InstName S4
SYMATTR Value MYSW
SYMBOL res 1488 400 R180
WINDOW 0 36 76 Left 2
WINDOW 3 36 40 Left 2
SYMATTR InstName R2
SYMATTR Value 1k
SYMBOL res 1392 576 R180
WINDOW 0 36 76 Left 2
WINDOW 3 36 40 Left 2
SYMATTR InstName R22
SYMATTR Value 1k
SYMBOL res 1488 576 R180
WINDOW 0 36 76 Left 2
WINDOW 3 36 40 Left 2
SYMATTR InstName R39
SYMATTR Value 4.7
SYMBOL e 1760 176 R0
SYMATTR InstName E4
SYMATTR Value 1
SYMBOL res 1648 608 R90
WINDOW 0 0 56 VBottom 2
WINDOW 3 32 56 VTop 2
SYMATTR InstName R7
SYMATTR Value 470
SYMBOL res 1536 1968 R90
WINDOW 0 0 56 VBottom 2
WINDOW 3 32 56 VTop 2
SYMATTR InstName R8
SYMATTR Value 470
SYMBOL cap 2320 704 R90
WINDOW 0 0 32 VBottom 2
WINDOW 3 32 32 VTop 2
SYMATTR InstName C12
SYMATTR Value 1n
SYMBOL cap 2176 2096 R90
WINDOW 0 0 32 VBottom 2
WINDOW 3 32 32 VTop 2
SYMATTR InstName C18
SYMATTR Value 1n
SYMBOL res 3888 336 R0
SYMATTR InstName R9
SYMATTR Value 4k7
SYMBOL res 3888 96 R0
SYMATTR InstName R10
SYMATTR Value 47
SYMBOL res 3696 1376 R0
SYMATTR InstName R20
SYMATTR Value 47
SYMBOL res 3696 1600 R0
SYMATTR InstName R51
SYMATTR Value 4k7
SYMBOL res -1136 -128 R0
SYMATTR InstName R70
SYMATTR Value 1k
SYMBOL voltage -1376 -32 R0
WINDOW 123 -36 191 Left 2
WINDOW 39 0 0 Left 0
WINDOW 3 -37 161 Left 2
SYMATTR Value2 AC 1
SYMATTR Value SINE(0 0.002 660 20m)
SYMATTR InstName V6
SYMBOL voltage -1632 -32 R0
WINDOW 123 -36 191 Left 2
WINDOW 39 0 0 Left 0
WINDOW 3 -37 161 Left 2
SYMATTR Value2 AC 1
SYMATTR Value SINE(0 0.0005 1100 20m)
SYMATTR InstName V7
SYMBOL voltage -1888 -32 R0
WINDOW 123 -36 191 Left 2
WINDOW 39 0 0 Left 0
WINDOW 3 -37 161 Left 2
SYMATTR Value2 AC 1
SYMATTR Value SINE(0 0.0005 1540 20m)
SYMATTR InstName V8
SYMBOL res 1504 1664 R90
WINDOW 0 0 56 VBottom 2
WINDOW 3 32 56 VTop 2
SYMATTR InstName R44
SYMATTR Value 1k
SYMBOL res 1728 2080 R0
SYMATTR InstName R45
SYMATTR Value 4k7
SYMBOL res 1648 2080 R0
SYMATTR InstName R65
SYMATTR Value 4k7
SYMBOL cap 1552 2096 R0
SYMATTR InstName C22
SYMATTR Value 100n
SYMBOL res 1840 720 R0
SYMATTR InstName R66
SYMATTR Value 4k7
SYMBOL res 1760 720 R0
SYMATTR InstName R71
SYMATTR Value 4k7
SYMBOL cap 1664 736 R0
SYMATTR InstName C23
SYMATTR Value 100n
TEXT -1840 -232 Left 2 !.tran 0 800m 30m 100u startup
TEXT 712 1128 Left 2 !.model MYSW SW(Ron=50 Roff=1Meg Vt=0 Vh=0)
TEXT 248 368 Left 2 !.include lf398.sub
TEXT -1448 -480 Left 2 ;30 Hz notch filter to prevent LF saturation of phasing circuit
TEXT -856 -536 Left 2 ;Input amplifier, the gain should be modified with respect to real guitar
TEXT 24 -568 Left 2 ;90° phasing circuit, works from about 60+ Hz
TEXT 552 -496 Left 2 ;Zero derivation detection circuit, U1 has to be replaced with comparator
TEXT 216 320 Left 2 ;Synchronous  peak detector
TEXT 808 1032 Left 2 ;Amplifier compensating the switch resistance
TEXT 2008 1216 Left 2 ;AGC circuit, sets gain so that output amplitude corresponds to input amplitude using the detected peak voltage
TEXT 2896 40 Left 2 ;Square-root circuit, uses logarithmic amplifier, division by 2 and exponentiator
TEXT 4024 224 Left 2 ;Switches which switch polarity of the sine wave
TEXT 4672 384 Left 2 ;Filter to filter out part of the polarity switching distortion
TEXT 1416 -392 Left 2 ;reference voltage for the switches, has no meaning for real circuit
TEXT -1232 -712 Left 2 !.four 110Hz 150 -1 V(wet)
TEXT -1232 -680 Left 2 !.OPTIONS plotwinsize=0
TEXT -1232 -648 Left 2 !.OPTIONS numdgt=7

gilbert.asc, the sub-circuit schematic file:
Version 4
SHEET 1 2600 1660
WIRE 288 -640 272 -640
WIRE -368 -416 -368 -608
WIRE -368 -416 -432 -416
WIRE -64 -416 -64 -608
WIRE 0 -416 -64 -416
WIRE -432 -256 -432 -416
WIRE -64 -256 -432 -256
WIRE 0 -224 0 -416
WIRE 0 -224 -368 -224
WIRE -832 -192 -832 -608
WIRE -208 -192 -832 -192
WIRE -432 -112 -432 -256
WIRE -368 -112 -368 -224
WIRE -64 -112 -64 -256
WIRE 0 -112 0 -224
WIRE -496 -64 -528 -64
WIRE -208 -64 -208 -192
WIRE -208 -64 -304 -64
WIRE -128 -64 -208 -64
WIRE 80 -64 64 -64
WIRE 288 -64 288 -640
WIRE 288 -64 80 -64
WIRE -432 32 -432 -16
WIRE -400 32 -432 32
WIRE -368 32 -368 -16
WIRE -368 32 -400 32
WIRE -64 32 -64 -16
WIRE -32 32 -64 32
WIRE 0 32 0 -16
WIRE 0 32 -32 32
WIRE -528 80 -528 -64
WIRE 80 80 80 -64
WIRE 80 80 -528 80
WIRE -400 128 -400 32
WIRE -32 128 -32 32
WIRE -560 176 -592 176
WIRE -464 176 -560 176
WIRE 160 176 32 176
WIRE 192 176 160 176
WIRE 384 192 352 192
WIRE -592 224 -592 176
WIRE 160 224 160 176
WIRE -400 256 -400 224
WIRE -352 256 -400 256
WIRE -32 256 -32 224
WIRE -32 256 -80 256
WIRE 384 256 384 192
WIRE 384 256 256 256
WIRE -400 304 -400 256
WIRE -32 304 -32 256
WIRE 384 304 384 256
WIRE -464 352 -528 352
WIRE 64 352 32 352
WIRE 256 352 256 256
WIRE 256 352 64 352
WIRE 320 352 256 352
WIRE -528 432 -528 352
WIRE 64 432 64 352
WIRE 64 432 -528 432
WIRE 384 448 384 400
WIRE -400 464 -400 400
WIRE -32 464 -32 400
WIRE -400 624 -400 544
WIRE -208 624 -400 624
WIRE -32 624 -32 544
WIRE -32 624 -208 624
WIRE -592 656 -592 288
WIRE -208 656 -208 624
WIRE -208 656 -592 656
WIRE 160 656 160 288
WIRE 160 656 -208 656
WIRE 384 656 384 528
WIRE 384 656 160 656
WIRE -560 688 -560 176
WIRE -208 688 -208 656
WIRE 192 688 192 176
FLAG -64 -608 OUTB
IOPIN -64 -608 Out
FLAG -368 -608 OUTA
IOPIN -368 -608 Out
FLAG -832 -608 CARRA
IOPIN -832 -608 In
FLAG 272 -640 CARRB
IOPIN 272 -640 In
FLAG 192 688 SIGB
IOPIN 192 688 In
FLAG -560 688 SIGA
IOPIN -560 688 In
FLAG -208 688 Vm
IOPIN -208 688 In
FLAG 352 192 BIAS
IOPIN 352 192 In
FLAG -80 256 GAINA
IOPIN -80 256 In
FLAG -352 256 GAINB
IOPIN -352 256 In
SYMBOL npn -464 128 R0
SYMATTR InstName Q5
SYMATTR Value MRF9411
SYMBOL npn -496 -112 R0
WINDOW 3 117 115 Left 2
SYMATTR Value MRF9411
SYMATTR InstName Q1
SYMBOL npn -128 -112 R0
WINDOW 3 113 114 Left 2
SYMATTR Value MRF9411
SYMATTR InstName Q3
SYMBOL npn -304 -112 M0
WINDOW 3 120 115 Left 2
SYMATTR Value MRF9411
SYMATTR InstName Q2
SYMBOL npn 64 -112 M0
WINDOW 3 120 112 Left 2
SYMATTR Value MRF9411
SYMATTR InstName Q4
SYMBOL npn 32 128 M0
SYMATTR InstName Q6
SYMATTR Value MRF9411
SYMBOL cap -608 224 R0
SYMATTR InstName C1
SYMATTR Value 2p
SYMBOL cap 144 224 R0
SYMATTR InstName C2
SYMATTR Value 2p
SYMBOL npn -464 304 R0
SYMATTR InstName Q7
SYMATTR Value MRF9411
SYMBOL npn 32 304 M0
SYMATTR InstName Q8
SYMATTR Value MRF9411
SYMBOL res -48 448 R0
SYMATTR InstName R1
SYMATTR Value 500
SYMBOL res -416 448 R0
SYMATTR InstName R2
SYMATTR Value 500
SYMBOL npn 320 304 R0
SYMATTR InstName Q9
SYMATTR Value MRF9411
SYMBOL res 368 432 R0
SYMATTR InstName R3
SYMATTR Value 500
TEXT -1312 -664 Left 0 !*Low Noise, High-Frequency Transistor\n*MOT Si 250mW  10V  50mA 8GHz \n.MODEL MRF9411 NPN \n+ IS = 4.558E-16 \n+ BF = 136 \n+ NF = 0.9979 \n+ VAF = 21 \n+ IKF = 0.7 \n+ ISE = 3.087E-14 \n+ NE = 2 \n+ BR = 42 \n+ NR = 0.993 \n+ VAR = 2.9 \n+ IKR = 0.016 \n+ ISC = 3.411E-17 \n+ NC = 1.087 \n+ RB = 7 \n+ IRB = 8E-05 \n+ RBM = 8 \n+ RE = 0.45 \n+ RC = 8 \n+ XTB = 0 \n+ EG = 1.11 \n+ XTI = 3 \n+ CJE = 8.6E-13 \n+ VJE = 0.94 \n+ MJE = 0.42 \n+ CJC = 4.3E-13 \n+ VJC = 0.35 \n+ MJC = 0.21 \n+ XCJC = 0.44 \n+ TF = 1.3E-11 \n+ XTF = 400 \n+ VTF = 6 \n+ ITF = 1.5 \n+ PTF = 47 \n+ TR = 1E-09 \n+ FC = 0.98
TEXT 480 -648 Left 0 ;>>>MEASURED PART DC PERFORMANCE<<<\nPIN     V(4v)     V(5V)     V(6v)     V(8v)\n1         1.35v    1.38v     1.39v     1.42v\n2         1.35v    1.38v     1.19v     1.42v\n3         GND     GND      GND      GND\n4         2.94v    3.90v     4.90v     6.83v \n5         2.96v    3.88v     4.88v     6.81v\n6         4.03v    4.95v     5.95v     7.97v\n7         3.25v    4.02v     5.02v     7.19v\n8          VDD     VDD      VDD       VDD\n \nIdd      2.0ma    2.2ma    2.3 ma    2.8ma
TEXT 520 328 Left 0 ;By:\nJoe Rocci\nW3JDR\njoe@roccis.com\nUp to date model files and application\ncircuit files can be found at:\nhttp://w3jdr.ham-radio-op.net
TEXT -528 -696 Left 0 ;>>>NE602/SA612 OSCILLATOR/MIXER IC MODEL<<<

The netlist it stands for:
* subharmonic_generator.asc
V1 N019 0 SINE(0 0.04 220 20m) AC 1
V2 +V 0 12
V3 0 -V 12
R1 N005 N010 10k
C1 N006 N005 47n
XU3 N011 N005 +V -V N006 level.2 Avol=1Meg GBW=10Meg Slew=10Meg ilimit=25m rail=0 Vos=0 phimargin=45 en=0 enk=0 in=0 ink=0 Rin=500Meg  ; pins IN+ IN- V+ V- OUT
A1 nclk 0 extreme 0 0 nclk clk 0 DFLOP Vhigh=5 Vlow=0 Ref=2.5 Trise=5n Tfall=5n Td=5n
V4 +5 0 5
S1 N030 N038 clk vref MYSW
R11 +5 vref 4k
R12 vref 0 1k
XU6 0 N034 +V -V N030 level.2 Avol=1Meg GBW=10Meg Slew=10Meg ilimit=25m rail=0 Vos=0 phimargin=45 en=0 enk=0 in=0 ink=0 Rin=5000Meg  ; pins IN+ IN- V+ V- OUT
R13 N034 N027 10k
R14 N030 N034 10k
S2 N027 N038 vref clk MYSW
XU7 0 N023 +V -V N024 level.2 Avol=1Meg GBW=10Meg Slew=10Meg ilimit=25m rail=0 Vos=0 phimargin=45 en=0 enk=0 in=0 ink=0 Rin=500Meg  ; pins IN+ IN- V+ V- OUT
D3 N024 N023 1N4148
D4 N023 N024 1N4148
R16 N036 N024 2k2
R17 0 N036 2k2
XU8 N036 N020 +V -V N020 level.2 Avol=1Meg GBW=10Meg Slew=10Meg ilimit=25m rail=0 Vos=0 phimargin=45 en=0 enk=0 in=0 ink=0 Rin=500Meg  ; pins IN+ IN- V+ V- OUT
D5 N020 N021 1N4148
D6 N021 N020 1N4148
XU9 0 N021 +V -V N027 level.2 Avol=1Meg GBW=10Meg Slew=10Meg ilimit=25m rail=0 Vos=0 phimargin=45 en=0 enk=0 in=0 ink=0 Rin=500Meg  ; pins IN+ IN- V+ V- OUT
R18 N026 N021 3k9
R19 N039 N038 3k3
C6 N039 0 10n
XU10 0 N015 +V -V N011 level.2 Avol=1Meg GBW=10Meg Slew=10Meg ilimit=25m rail=0 Vos=0 phimargin=45 en=0 enk=0 in=0 ink=0 Rin=500Meg  ; pins IN+ IN- V+ V- OUT
C8 N015 N011 150n
R3 N006 N015 330k
S5 N053 N045 vref clk MYSW
S6 N044 N045 clk vref MYSW
C3 N024 N023 100p
C4 N026 N021 100p
R23 N040 N039 3k3
C13 N040 0 10n
XU2 N042 wet +V -V wet level.2 Avol=1Meg GBW=10Meg Slew=10Meg ilimit=25m rail=0 Vos=0 phimargin=45 en=0 enk=0 in=0 ink=0 Rin=500Meg  ; pins IN+ IN- V+ V- OUT
XU4 N009 N002 +V -V N004 level.2 Avol=1Meg GBW=10Meg Slew=10Meg ilimit=25m rail=0 Vos=0 phimargin=45 en=0 enk=0 in=0 ink=0 Rin=500Meg  ; pins IN+ IN- V+ V- OUT
C14 N007 N013 1µ
R24 0 N007 100k
R26 N003 N002 330
R27 N002 0 330
R28 N004 N003 10k
R29 0 half-wet 2k2
R30 half-wet wet 4k4
XU14 N025 nclk lref -V N047 N044 +V LF398J  ; pins Input Logic Logic_ref V- Ch Out V+
C16 N047 0 100n
XU11 N025 clk lref -V N056 N053 +V LF398J  ; pins Input Logic Logic_ref V- Ch Out V+
C10 N056 0 100n
R6 +5 N046 1k
R31 N046 0 1k
E1 lref 0 N046 0 1
D1 N020 N021 1N4148
D2 N021 N020 1N4148
XU13 0 N059 +V -V N060 level.2 Avol=1Meg GBW=10Meg Slew=10Meg ilimit=25m rail=0 Vos=0 phimargin=45 en=0 enk=0 in=0 ink=0 Rin=500Meg  ; pins IN+ IN- V+ V- OUT
D7 N060 N059 1N4148
D8 N059 N060 1N4148
R34 N068 N060 2k2
R35 0 N068 2k2
XU15 N068 N057 +V -V N057 level.2 Avol=1Meg GBW=10Meg Slew=10Meg ilimit=25m rail=0 Vos=0 phimargin=45 en=0 enk=0 in=0 ink=0 Rin=500Meg  ; pins IN+ IN- V+ V- OUT
D9 N057 N058 1N4148
D10 N058 N057 1N4148
XU16 0 N058 +V -V N055 level.2 Avol=1Meg GBW=10Meg Slew=10Meg ilimit=25m rail=0 Vos=0 phimargin=45 en=0 enk=0 in=0 ink=0 Rin=500Meg  ; pins IN+ IN- V+ V- OUT
R36 N061 N058 3k9
C11 N060 N059 100p
C17 N061 N058 100p
D11 N057 N058 1N4148
D12 N058 N057 1N4148
XU18 0 N054 +V -V AGC level.2 Avol=1Meg GBW=10Meg Slew=10Meg ilimit=25m rail=0 Vos=0 phimargin=45 en=0 enk=0 in=0 ink=0 Rin=500Meg  ; pins IN+ IN- V+ V- OUT
R4 N055 N054 2k
C7 AGC N054 10n
R41 N010 N004 1k
C9 N010 N014 10µ
R42 N014 0 1k5
E3 N025 0 N004 0 1
R21 N008 N007 68k
R25 N009 N008 68k
C5 0 N008 100n
C15 N012 N007 100n
C19 N009 N012 100n
R32 N012 0 18k
XU12 N006 N001 +V -V derivation level.2 Avol=1Meg GBW=10Meg Slew=10Meg ilimit=25m rail=0 Vos=0 phimargin=45 en=0 enk=0 in=0 ink=0 Rin=500Meg  ; pins IN+ IN- V+ V- OUT
R33 derivation N001 4k7
R37 N001 0 1k
R38 N041 N040 3k3
C20 N041 0 10n
R40 N042 N041 3k3
C21 N042 0 10n
R53 N054 N050 2k7
XX1 N070 N064 0 N072 N066 N069 N065 N071 N062 N063 gilbert
V5 -5 0 -5
R55 N072 +V 22k
R56 +V N066 47k
R57 +V N069 47k
R58 N063 N062 100
R59 AGC N065 680k
XU17 N069 N066 +V -V N067 level.2 Avol=1Meg GBW=10Meg Slew=10Meg ilimit=25m rail=0 Vos=0 phimargin=45 en=0 enk=0 in=0 ink=0 Rin=500Meg  ; pins IN+ IN- V+ V- OUT
R43 N067 N066 220k
R46 0 N069 220k
R48 N059 N067 1k
R49 0 N072 1k
R50 N050 N064 1k
R60 N064 0 4.7
R47 N070 0 4.7
XX2 N043 N035 0 N051 N032 N037 N031 N048 N028 N029 gilbert
R52 N051 +V 22k
R54 +V N032 47k
R61 +V N037 47k
R62 N029 N028 100
R63 N022 N031 680k
XU19 N037 N032 +V -V N033 level.2 Avol=1Meg GBW=10Meg Slew=10Meg ilimit=25m rail=0 Vos=0 phimargin=45 en=0 enk=0 in=0 ink=0 Rin=500Meg  ; pins IN+ IN- V+ V- OUT
R64 N033 N032 220k
R67 0 N037 220k
R68 N023 N033 1k
R69 0 N051 1k
R72 N043 0 4.7
XU1 0 derivation +5 -5 extreme level.2 Avol=1Meg GBW=10Meg Slew=10Meg ilimit=25m rail=0 Vos=0 phimargin=45 en=0 enk=0 in=0 ink=0 Rin=500Meg  ; pins IN+ IN- V+ V- OUT
XU20 0 N049 +V -V N050 level.2 Avol=1Meg GBW=10Meg Slew=10Meg ilimit=25m rail=0 Vos=0 phimargin=45 en=0 enk=0 in=0 ink=0 Rin=500Meg  ; pins IN+ IN- V+ V- OUT
R5 N049 N045 10k
R15 N052 N049 10k
C2 N050 N049 1n
S3 N052 N050 +5 0 MYSW
S4 N050 N050 +5 0 MYSW
R2 N035 N025 1k
R22 N050 N035 1k
R39 0 N035 4.7
E4 N022 0 AGC 0 1
R7 N043 0 470
R8 N070 0 470
C12 0 N051 1n
C18 0 N072 1n
R9 N026 N027 4k7
R10 0 N026 47
R20 0 N061 47
R51 N061 N055 4k7
R70 N013 N019 1k
V6 N018 0 SINE(0 0.002 660 20m) AC 1
V7 N017 0 SINE(0 0.0005 1100 20m) AC 1
V8 N016 0 SINE(0 0.0005 1540 20m) AC 1
R44 N064 0 1k
R45 N071 -V 4k7
R65 N071 0 4k7
C22 N071 0 100n
R66 N048 -V 4k7
R71 N048 0 4k7
C23 N048 0 100n

* block symbol definitions
.subckt gilbert SIGA SIGB CARRA CARRB OUTA OUTB BIAS Vm GAINA GAINB
Q5 N001 SIGA GAINB 0 MRF9411
Q1 OUTA CARRB N001 0 MRF9411
Q3 OUTA CARRA N002 0 MRF9411
Q2 OUTB CARRA N001 0 MRF9411
Q4 OUTB CARRB N002 0 MRF9411
Q6 N002 SIGB GAINA 0 MRF9411
C1 SIGA Vm 2p
C2 SIGB Vm 2p
Q7 GAINB BIAS N004 0 MRF9411
Q8 GAINA BIAS N005 0 MRF9411
R1 N005 Vm 500
R2 N004 Vm 500
Q9 BIAS BIAS N003 0 MRF9411
R3 N003 Vm 500
*Low Noise, High-Frequency Transistor
*MOT Si 250mW  10V  50mA 8GHz
.MODEL MRF9411 NPN
+ IS = 4.558E-16
+ BF = 136
+ NF = 0.9979
+ VAF = 21
+ IKF = 0.7
+ ISE = 3.087E-14
+ NE = 2
+ BR = 42
+ NR = 0.993
+ VAR = 2.9
+ IKR = 0.016
+ ISC = 3.411E-17
+ NC = 1.087
+ RB = 7
+ IRB = 8E-05
+ RBM = 8
+ RE = 0.45
+ RC = 8
+ XTB = 0
+ EG = 1.11
+ XTI = 3
+ CJE = 8.6E-13
+ VJE = 0.94
+ MJE = 0.42
+ CJC = 4.3E-13
+ VJC = 0.35
+ MJC = 0.21
+ XCJC = 0.44
+ TF = 1.3E-11
+ XTF = 400
+ VTF = 6
+ ITF = 1.5
+ PTF = 47
+ TR = 1E-09
+ FC = 0.98
* >>>MEASURED PART DC PERFORMANCE<<<
* PIN     V(4v)     V(5V)     V(6v)     V(8v)
* 1         1.35v    1.38v     1.39v     1.42v
* 2         1.35v    1.38v     1.19v     1.42v
* 3         GND     GND      GND      GND
* 4         2.94v    3.90v     4.90v     6.83v
* 5         2.96v    3.88v     4.88v     6.81v
* 6         4.03v    4.95v     5.95v     7.97v
* 7         3.25v    4.02v     5.02v     7.19v
* 8          VDD     VDD      VDD       VDD
* Idd      2.0ma    2.2ma    2.3 ma    2.8ma
* By:
* Joe Rocci
* W3JDR
* joe@roccis.com
* Up to date model files and application
* circuit files can be found at:
* http://w3jdr.ham-radio-op.net
* >>>NE602/SA612 OSCILLATOR/MIXER IC MODEL<<<
.ends gilbert

.model D D
.lib standard.dio
.model NPN NPN
.model PNP PNP
.lib standard.bjt
.tran 0 800m 30m 100u startup
.model MYSW SW(Ron=50 Roff=1Meg Vt=0 Vh=0)
.include lf398.sub
* 30 Hz notch filter to prevent LF saturation of phasing circuit
* Input amplifier, the gain should be modified with respect to real guitar
* 90° phasing circuit, works from about 60+ Hz
* Zero derivation detection circuit, U1 has to be replaced with comparator
* Synchronous  peak detector
* Amplifier compensating the switch resistance
* AGC circuit, sets gain so that output amplitude corresponds to input amplitude using the detected peak voltage
* Square-root circuit, uses logarithmic amplifier, division by 2 and exponentiator
* Switches which switch polarity of the sine wave
* Filter to filter out part of the polarity switching distortion
* reference voltage for the switches, has no meaning for real circuit
.four 110Hz 150 -1 V(wet)
.OPTIONS plotwinsize=0
.OPTIONS numdgt=7
.lib UniversalOpamps2.sub
.backanno
.end